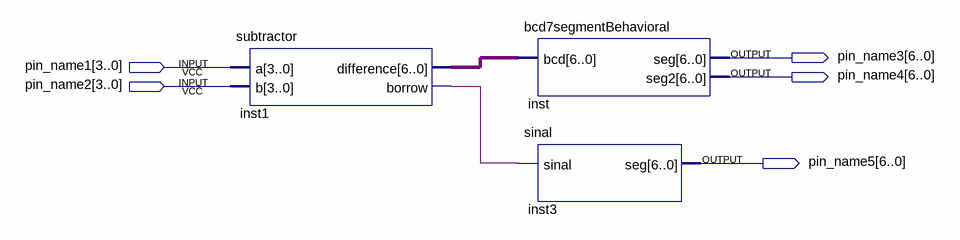
[diagram p0: schematic sheet]
// Quartus schematic subtraidor.bdf as structural Verilog: 3 symbols, 5 pins
module subtraidor (
  input  [3:0] pin_name1,
  input  [3:0] pin_name2,
  output [6:0] pin_name3,
  output [6:0] pin_name4,
  output [6:0] pin_name5
);

  wire inst1_borrow;
  wire [6:0] inst1_difference;

  subtractor inst1 (.a(pin_name1), .b(pin_name2), .difference(inst1_difference), .borrow(inst1_borrow));
  bcd7segmentBehavioral inst (.bcd(inst1_difference), .seg(pin_name3), .seg2(pin_name4));
  sinal inst3 (.sinal(inst1_borrow), .seg(pin_name5));
endmodule
